# EAGLE design midi-to-audio (EAGLE 5.11)
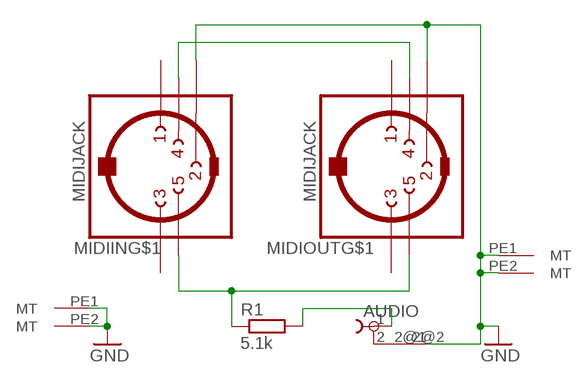
[diagram p0: schematic, sheet 1]

## Parts
AUDIO  TOBU3  [TOBU3]
MIDIIN  MIDIJACK  [CP-2350]
MIDIOUT  MIDIJACK  [CP-2350]
R1  5.1k  R-EU_0207/10  [0207/10]

## Nets
GND: AUDIO.2@2 MIDIIN.2 MIDIIN.PE1(MT) MIDIIN.PE2(MT) MIDIOUT.2 MIDIOUT.PE1(MT) MIDIOUT.PE2(MT)
N$1: MIDIIN.4 MIDIOUT.4
N$3: MIDIIN.5 MIDIOUT.5 R1.1
N$4: AUDIO.1 R1.2
Unconnected: AUDIO.2 AUDIO.2@1 MIDIIN.1 MIDIIN.3 MIDIIN.PE(MT) MIDIIN.PE@(MT) MIDIOUT.1 MIDIOUT.3 MIDIOUT.PE(MT) MIDIOUT.PE@(MT)

## Library data of the parts
AUDIO = con-hirschmann:TOBU3: Female Cinch CONNECTOR ( RCA Jack ); MF: FARNELL; MPN: TOBU 3; OC_FARNELL: 592791; OC_NEWARK: 06WX5914
MIDIIN MIDIOUT = adafruit:MIDIJACK: DIN 5 jack also known as MIDI jack A modification of conn-hirshman:MAB5SH with two options for the grounding 'teeth'
R1 = rcl:R-EU_: RESISTOR, European symbol

## Net classes
0 default: width 0.61 mm

## Board
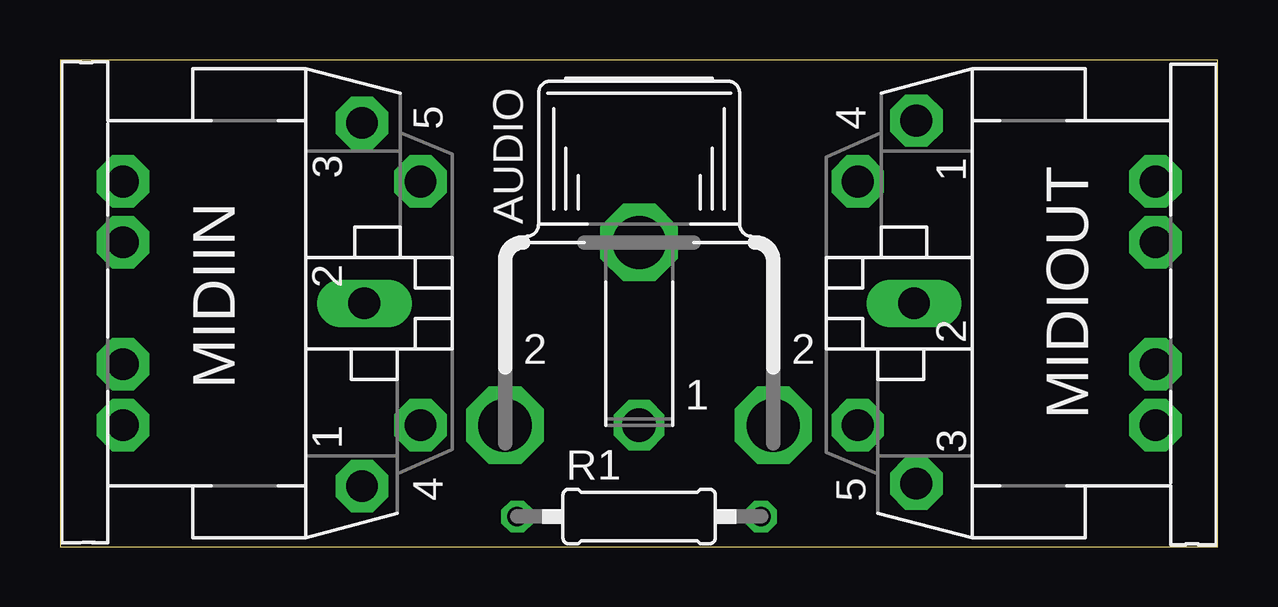
[diagram p1: board, top side]
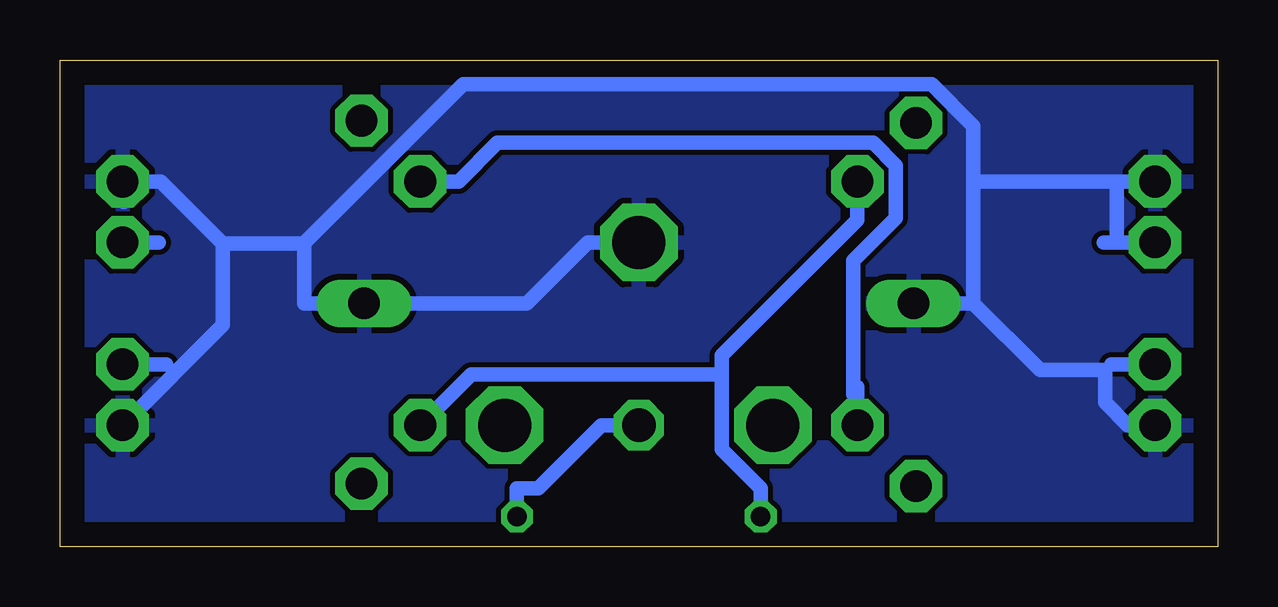
[diagram p2: board, bottom side, seen from below]

Size 48.25 x 20.31 mm. Coordinates in mm from the lower left corner, seen from the top.
Outline: 0,0 48.25,0 48.25,20.31 0,20.31 0,0
Copper layers (1*16): Top 0.035mm / dielectric 1.5mm / Bottom 0.035mm
Design rules "default": minimum track width 10mil, minimum drill 24mil, track to track 8mil, track to pad 8mil, pad to pad 8mil, via to via 8mil, smd to smd 8mil, copper to edge 40mil, drill to drill 8mil, minimum pad ring 10mil, minimum via ring 8mil, stop-mask expansion 4mil, vias tented up to drill 0mil, thermal gap 10mil

### Footprints (pad centres in the part's own frame; a part is rotated, then mirrored left to right if it is on the bottom)
TOBU3 = drill 1.397 octagon: 1 0,-2.54 | drill 2.21 octagon: 2 5.588,-2.54; 2@1 -5.588,-2.54; 2@2 0,5.08
CP-2350 = drill 1.321 pad 2.184 octagon: 1 7.62,12.58; 3 -7.52,12.58; 4 5.08,15.02; 5 -5.08,15.02; PE -2.54,2.62; PE1 -5.08,2.62; PE2 5.08,2.62; PE@ 2.54,2.62 | drill 1.321 long: 2 0,12.68
0207/10 = drill 0.813 octagon: 1 -5.08,0; 2 5.08,0

### Placement (x,y rotation side)
AUDIO  24.13,7.62 0 top
MIDIIN  0,10.16 270 top
MIDIOUT  48.26,10.16 90 top
R1  24.13,1.27 0 top

### Tracks (layer width: path | path; a pad name or v marks a point on that pad's centre or on a via)
GND
  Bottom 0.61: 45.6,14.37 45.64,14.41 MIDIOUT.PE2 44.04,15.24 41.46,12.66 | 10.19,10.16 7.41,7.38 4.69,7.38 4.69,6.02 3.75,5.08 MIDIIN.PE2 | 4.22,15.24 4.22,12.87 4.3,12.79 | 10.19,15.24 4.22,15.24 | 38.08,12.66 31.45,19.3 11.93,19.3 10.19,17.56 10.19,15.24 | 10.19,10.16 10.19,15.24 | 10.19,10.16 MIDIIN.2 | 4.22,15.24 MIDIIN.PE1 | 38.08,12.66 41.46,12.66 | 41.46,12.66 41.46,9.26 MIDIOUT.PE1 | 38.08,12.66 38.07,12.65 38.07,10.16 MIDIOUT.2 28.79,10.16 26.25,12.7 AUDIO.2@2
  pour Bottom: 0,0 0,20 48.26,20 48.26,0
N$1
  Bottom 0.61: 15.02,6.19 15.02,6.68 | MIDIIN.4 15.02,6.19 | 15.02,6.19 15.19,6.36 15.19,11.95 13.42,13.72 13.42,15.91 14.37,16.86 30.02,16.86 31.64,15.24 MIDIOUT.4
N$2
  Bottom 0.61: 2.86,12.7 4.76,12.7
N$3
  Bottom 0.61: 20.68,7.21 20.68,7.98 15.02,13.64 MIDIIN.5 | 20.68,7.21 20.68,4.06 19.05,2.44 R1.1 | MIDIOUT.5 31.11,7.21 20.68,7.21
N$4
  Bottom 0.61: R1.2 29.21,2.44 28.33,2.44 25.69,5.08 AUDIO.1
N$5
  Bottom 0.61: 2.54,7.62 4.45,7.62
N$6
  Bottom 0.61: 45.72,12.7 44.13,12.7
N$7
  Bottom 0.61: 45.72,7.62 43.81,7.62